# Altium project WIZARD_POC.PrjPcb
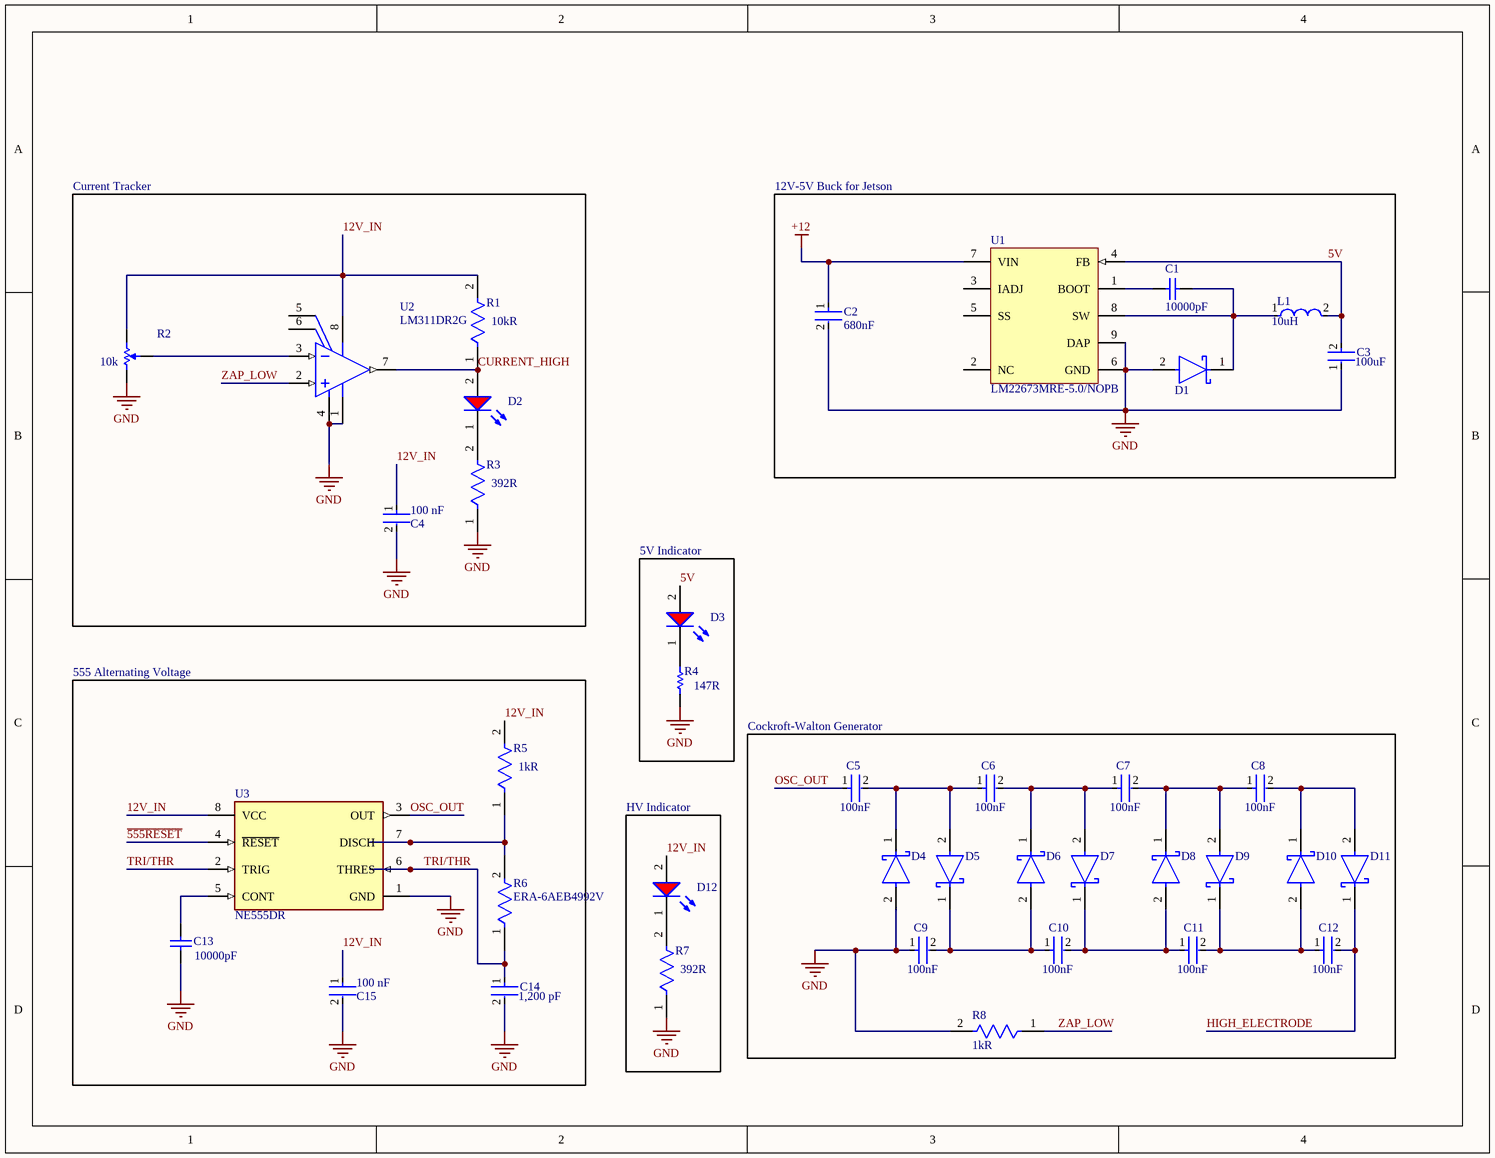
[diagram p0: WIZARD_HV.SchDoc]
2 sheets, 59 parts. Net scope: global (net labels, ports and power ports of the same name join across sheets).
Board file: WIZARD_100V.PcbDoc
Sheets:
  WIZARD_HV.SchDoc
  WIZARD_Control.SchDoc

## Sheet WIZARD_HV.SchDoc
size Letter; SheetNumber: 1; SheetTotal: 2

### Parts
C1  Capacitance: 10000pF  [CAPC2013X75X45LL10T25]  (hidden comment: CL21B103KBANNNC)
C2  Capacitance: 680nF  [FP-CGA4J-MFG]  (hidden comment: CGA4J3X7R1E684K125AB)
C3  Parameter 1: 100uF  [FP-GRM31C-0_3-e0_3_0_8-IPC_B]  (hidden comment: GRM31CR61A107MEA8L)
C4  Capacitance: 100 nF  [FP-CC0805-0_85-MFG]  (hidden comment: CC0805KRX7R9BB104)
C5  Capacitance: 100nF  [FP-C2012-125-0_2-IPC_B]  (hidden comment: C2012X7T2E104K125AA)
C6  Capacitance: 100nF  [FP-C2012-125-0_2-IPC_B]  (hidden comment: C2012X7T2E104K125AA)
C7  Capacitance: 100nF  [FP-C2012-125-0_2-IPC_B]  (hidden comment: C2012X7T2E104K125AA)
C8  Capacitance: 100nF  [FP-C2012-125-0_2-IPC_B]  (hidden comment: C2012X7T2E104K125AA)
C9  Capacitance: 100nF  [FP-C2012-125-0_2-IPC_B]  (hidden comment: C2012X7T2E104K125AA)
C10  Capacitance: 100nF  [FP-C2012-125-0_2-IPC_B]  (hidden comment: C2012X7T2E104K125AA)
C11  Capacitance: 100nF  [FP-C2012-125-0_2-IPC_B]  (hidden comment: C2012X7T2E104K125AA)
C12  Capacitance: 100nF  [FP-C2012-125-0_2-IPC_B]  (hidden comment: C2012X7T2E104K125AA)
C13  Capacitance: 10000pF  [CAPC2013X75X45LL10T25]  (hidden comment: CL21B103KBANNNC)
C14  Capacitance: 1,200 pF  [FP-C0805C-DN-MFG]  (hidden comment: C0805C122K5RACTU)
C15  Capacitance: 100 nF  [FP-CC0805-0_85-MFG]  (hidden comment: CC0805KRX7R9BB104)
D1  SK520B  [FP-SMB-MFG]  (value not drawn)
D2  150080RS75000  [WL-SMCW_0805_150080xx75000]  (value not drawn)
D3  150080RS75000  [WL-SMCW_0805_150080xx75000]  (value not drawn)
D4  SK520B  [FP-SMB-MFG]  (value not drawn)
D5  SK520B  [FP-SMB-MFG]  (value not drawn)
D6  SK520B  [FP-SMB-MFG]  (value not drawn)
D7  SK520B  [FP-SMB-MFG]  (value not drawn)
D8  SK520B  [FP-SMB-MFG]  (value not drawn)
D9  SK520B  [FP-SMB-MFG]  (value not drawn)
D10  SK520B  [FP-SMB-MFG]  (value not drawn)
D11  SK520B  [FP-SMB-MFG]  (value not drawn)
D12  150080RS75000  [WL-SMCW_0805_150080xx75000]  (value not drawn)
L1  Inductance: 10uH  [FP-SRP1038A-100M-MFG]  (hidden comment: SRP1038A-100M)
R1  Resistance: 10kR  [FP-RR1220-IPC_A]  (hidden comment: RR1220P-103-D)
R2  Resistance (Ohms): 10k  [RES-POT-3]  (hidden comment: P090S-14T20BR10K)
R3  Resistance: 392R  [FP-RMCF0805-IPC_A]  (hidden comment: RMCF0805FT392R)
R4  value 147R  [RESC2013X60X35NL10T20]  (hidden comment: RC0805FR-07147RL)
R5  Resistance: 1kR  [FP-RR1220-IPC_A]  (hidden comment: RR1220P-102-D)
R6  ERA-6AEB4992V  [FP-ERA6A_MFG]
R7  Resistance: 392R  [FP-RMCF0805-IPC_A]  (hidden comment: RMCF0805FT392R)
R8  Resistance: 1kR  [FP-RR1220-IPC_A]  (hidden comment: RR1220P-102-D)
U1  LM22673MRE-5.0/NOPB  [MRA08B_L]
U2  LM311DR2G  [ONSC-SOIC-8-751-07_V]
U3  NE555DR  [FP-D0008A-IPC_A]

### Blocks framed on the sheet
Current Tracker: C4 D2 R1-R3 U2
12V-5V Buck for Jetson: C1-C3 D1 L1 U1
5V Indicator: D3 R4
555 Alternating Voltage: C13-C15 R5 R6 U3
Cockroft-Walton Generator: C5-C12 D4-D11 R8
HV Indicator: D12 R7

### Nets
+12: C2.1 U1.7(VIN)
GND: C2.2 C3.1 C4.2 C9.1 C13.1 C14.2 C15.2 D1.2(A) D4.2(A) R2.1 R3.1 R4.1 R7.1 R8.2 U1.6(GND) U1.9(DAP) U2.1(GND) U2.4(VEE) U3.1(GND)
~{555RESET}: U3.4(~{RESET})
5V: C3.2 D3.2(A) L1.2 U1.4(FB)
12V_IN: C4.1 C15.1 D12.2(A) R1.2 R2.3 R5.2 U2.8(VCC) U3.8(VCC)
CURRENT_HIGH: D2.2(A) R1.1 U2.7(OUT)
HIGH_ELECTRODE: C12.2 D11.1(C)
OSC_OUT: C5.1 U3.3(OUT)
TRI/THR: C14.1 R6.1 U3.2(TRIG) U3.6(THRES)
ZAP_LOW: R8.1 U2.2(IN+)
NetC1_1: C1.1 D1.1(C) L1.1 U1.8(SW)
NetC1_2: C1.2 U1.1(BOOT)
NetC5_2: C5.2 C6.1 D4.1(C) D5.2(A)
NetC6_2: C6.2 C7.1 D6.1(C) D7.2(A)
NetC7_2: C7.2 C8.1 D8.1(C) D9.2(A)
NetC8_2: C8.2 D10.1(C) D11.2(A)
NetC9_2: C9.2 C10.1 D5.1(C) D6.2(A)
NetC10_2: C10.2 C11.1 D7.1(C) D8.2(A)
NetC11_2: C11.2 C12.1 D9.1(C) D10.2(A)
NetC13_2: C13.2 U3.5(CONT)
NetD2_1: D2.1(K) R3.2
NetD3_1: D3.1(K) R4.2
NetD12_1: D12.1(K) R7.2
NetR2_2: R2.2 U2.3(IN-)
NetR5_1: R5.1 R6.2 U3.7(DISCH)

Not connected (* = marked no-connect by the designer): U1 2(NC) 3(IADJ) 5(SS); U2 5(BALANCE) 6(BALANCE/STROBE)

### Library data of the parts
C1 C13 = CMP-2000-06105-1: Multilayer Ceramic Capacitor, 10 nF, 50 V, -55 to 125 degC, 2-Pin SMD, RoHS, Tape and Reel; Manufacturer: Samsung Electro-Mechanics; Tolerance (%): ±10%; Dielectric: X7R; Rated Voltage: 50V; Package Description: 2-Pin Surface Mount Device, Body 2 x 1.25 mm; Datasheet Version: 11/2010; Package Reference: 0805; Case Size/Dimension: 0805; Datasheet URL: https://datasheet.ciiva.com/29199/455082-da-01-en-vs-kondensator-0805-29199459.pdf; Mounting Technology: SurfaceMount; Manufacturer URL: http://www.samsungsem.com/global/index.jsp
C2 = CMP-08246-002437-1: Cap Ceramic 680nF 25V X7R 10% Pad SMD 0805 +125°C Automotive T/R; Case Code (Imperial): 0805; Termination: SMD/SMT; Ratings: AEC-Q200; Height: 1.25mm; Depth: 1.25mm; Max Operating Temperature: 125°C; Case Code (Metric): 2012; Lead Free: Lead Free; Width: 0.049inch; Weight: 0.000194oz; Min Operating Temperature: -55°C; Package Quantity: 2000; Dielectric: X7R; Case/Package: 0805; REACH SVHC: No SVHC; Thickness: 0.057inch; Mount: Surface Mount; Composition: Ceramic; Voltage Rating: 25V; Length: 2mm; Packaging: Tape and Reel; Tolerance: 10%; Voltage Rating (DC): 25V
C3 = CMP-06035-033997-1: Chip Multilayer Ceramic Capacitors for General Purpose, 1206, 100uF, X5R, 15%, 20%, 10V
C4 C15 = CMP-2100-03606-3: CAP CER 0.1UF 50V X7R 0805; Manufacturer: Yageo; Tolerance: 0.1; Value: 100 nF; Material: Ceramic; Device Class L1: Passive Components; ComponentLink2Description: Datasheet; Package: CC0805-0.85; Manufacturer Part Number: CC0805KRX7R9BB104; Digikey Description: CAP CER 0.1UF 50V X7R 0805; Device Class L3: Ceramic Capacitors; Temperature: -30°C to +85°C; Temperature Characteristic: X7R; Voltage Rating: 50 V; Height: 0.95mm; RoHS: TRUE; Ipc Land Pattern Name: CAPC200125X85; Device Class L2: Capacitors; Category: Cap; Temperature Range Low: -30°C; Temperature Range High: +85°C; Mouser Description: Multilayer Ceramic Capacitors MLCC - SMD/SMT 100nF 50V X7R 10%; Footprint Url: http://www.yageo.com/exep/pages/download/literatures/UPY-C_GEN_24.pdf; Automotive: No; Octopart: https://octopart.com/cc0805krx7r9bb104-yageo-192993; Lead Free: Yes; ComponentLink2URL: http://www.yageo.com/documents/recent/UPY-GPHC_Y5V_6.3V-to-50V_8.pdf
C5-C12 = CMP-08246-006438-1: Multilayer Ceramic Capacitors 100nF ±10% 250V X7T SMD 0805; Depth: 1.25mm; Package Quantity: 1; Case/Package: 0805; Case Code (Metric): 2012; Case Code (Imperial): 0805; Thickness: 0.057inch; Tolerance: 10%; Length: 2mm; Radiation Hardening: No; Max Operating Temperature: 125°C; Voltage Rating (DC): 250V; Height: 1.25mm; Construction: Flat; Dielectric: X7T; Min Operating Temperature: -55°C; RoHS Compliant: Yes; REACH SVHC: No SVHC; Width: 0.049inch; Series: C; Packaging: Tape and Reel; Lead Free: Lead Free; Mount: Surface Mount; Voltage Rating: 250V
C14 = CMP-2007-00286-2: CAP CER 1200PF 50V 10% X7R 0805; Manufacturer: KEMET; Temperature Coefficient: 30ppm/°C; Tolerance: 0.1; Material: Ceramic; Value: 1,200 pF; Manufacturer Part Number: C0805C122K5RACTU; Temperature: -55°C to +125°C; Package: C0805C-DN; ComponentLink2Description: Datasheet; RoHS: TRUE; Height: 0.88mm; Device Class L2: Capacitors; Automotive: No; Voltage Rating: 50 V; Temperature Range High: +125°C; Octopart: https://octopart.com/c0805c122k5ractu-kemet-8370191; Ipc Land Pattern Name: CAPC200125X78; Category: Cap; Device Class L3: Ceramic Capacitors; Temperature Characteristic: X7R; Lead Free: Yes; Mouser Description: Cap Ceramic 0.0012uF 50V X7R 10% SMD 0805 125C Plastic T/R; ComponentLink2URL: https://content.kemet.com/datasheets/KEM_C1003_C0G_SMD.pdf; Device Class L1: Passive Components; Digikey Description: CAP CER 1200PF 50V 10% X7R 0805; Temperature Range Low: -55°C
D1 D4-D11 = CMP-10078-124483505-1: SK520B Diode Schottky 200V 5A Smb; Peak Reverse Current: 200nA; Capacitance: 140pF; Max Junction Temperature (Tj): 150°C; Max Forward Surge Current (Ifsm): 110A; Max Repetitive Reverse Voltage (Vrrm): 200V; NexarPartId: 124483505; Case/Package: SMB; Forward Current: 5A; Max Operating Temperature: 150°C; Min Operating Temperature: -55°C; Height: 2.6mm; Reverse Voltage: 200V
D2 D3 D12 = CMP-1426-00011-3: LED Uni-Color Red 630nm 2-Pin Chip 0805(2012Metric) T/R; Viewing Angle: 140°; Max Junction Temperature (Tj): 95°C; Power Dissipation: 72mW; Forward Current: 100mA; Forward Voltage: 2V; Wavelength: 625nm; Test Current: 20mA; Max Reverse Voltage (DC): 5V; Luminous Intensity: 150mcd; Lens Style: Clear, Rectangular; REACH SVHC: Unknown; Height: 700µm; Case Code (Metric): 2012; Peak Wavelength: 630nm; Length: 2mm; Width: 1.25mm; RoHS: Compliant; Packaging: Tape and Reel; Dominant Wavelength: 625nm; Color: Red; Case Code (Imperial): 0805; Min Operating Temperature: -40°C; Mount: Surface Mount; Max Operating Temperature: 85°C; Case/Package: 0805
L1 = CMP-07248-000083-1: FIXED IND 10UH 7.5A 30 MOHM SMD; Tolerance: 20%; Test Frequency: 100kHz; Self Resonant Frequency: 10MHz; Q Factor: 20; Core Material: Carbonyl Powder; Shielding: Shielded; DC Resistance (DCR): 30mR; Saturation Current: 12A; Mount: Surface Mount; Military Standard: Not; Max Operating Temperature: 150°C; Length: 11mm; Min Operating Temperature: -40°C; Ratings: AEC-Q200; Termination: SMD/SMT; RMS Current (Irms): 7.5A; Packaging: Tape and Reel; RoHS Compliant: Yes; Width: 0.394inch; Height: 3.8mm; Package Quantity: 500; DC Current: 7.5A; Case/Package: Nonstandard; Depth: 10.3mm; Max DC Current: 7.5A; Height - Seated (Max): 0.157inch; REACH SVHC: No SVHC; Resistor Type: Wirewound; Current Rating: 7.5A; Inductance Tolerance: 20%
R1 = CMP-2001-03215-2: 10kΩ ±0.5% 0.1W 1/10W Chip Resistor 0805 (2012 Metric) Thin Film; Max Power Dissipation: 100mW; Voltage Rating: 100V; Temperature Coefficient: 25ppm/°C; Size Code: 0805; RoHS Compliant: Yes; Package Quantity: 1; Resistance Tolerance: 0.5%; Depth: 1.25mm; Lead Free: Lead Free; Series: RR; Min Operating Temperature: -55°C; Weight: 0.000194oz; Width: 1.25mm; Packaging: Tape and Reel; Termination: SMD/SMT; Length: 2mm; Power Rating: 100mW; Case Code (Metric): 2012; Resistor Type: Thin Film; Height: 0.4mm; Case/Package: 0805; Case Code (Imperial): 0805; Technology: THIN FILM; Max Operating Temperature: 125°C; Voltage Rating (DC): 100V; Number of Terminations: 2; Tolerance: 0.5%
R2 = CMP-2000-06871-1: 9 mm Rotary Potentiometer, Insulated Shaft, Conductive Plastic Element, 10 KOhm, -20 to 70 degC, 3-Pin THD, RoHS, Tray; Manufacturer: BI Technologies; Actuator Type: Knurled; Power Rating: 0.03W; Tolerance: ±20%; Actuator Diameter: 0.236"(6.00mm); Other Names: 987-1277P090S14T20BR10K; Actuator Length: 0.787"(20.00mm); Number of Gangs: 1; Online Catalog: P090Series; Power (Watts): 0.03W,1/32W; Built in Switch: Detent; Adjustment Type: TopAdjustment; Rotation: 280°; Package Description: POT, 3-Leads, Body 9.8 x 12.5 mm, Pitch 2.5 mm; Bushing Thread: -; Package Reference: POT-3; Datasheet URL: http://www.bitechnologies.com/pdfs/p090.pdf; Packaging: Tray; Manufacturer URL: http://www.bi-technologies.net/; Package URL: http://www.bitechnologies.com/pdfs/p090.pdf; Mounting Technology: ThroughHole; Datasheet Version: 07/2008; Taper: Linear; Resistive Material: ConductivePlastic; Mounting Type: ThroughHole; Temperature Coefficient: -; Standard Package: 1; Category: Potentiometers,VariableResistors; Family: RotaryPotentiometers,Rheostats; Termination Style: PCBPins,BoardLocks; Series: P090; Number of Turns: 1
R3 R7 = CMP-26527-007282-1: 392Ω ±1% 0.125W 0805 Thick Film Chip Resistor AEC-Q200 compliant; Temperature Coefficient: 100ppm/°C; Max Power Dissipation: 125mW; Number of Terminations: 2; Size Code: 0805; Tolerance: 1%; Radiation Hardening: No; Packaging: Tape and Reel; Resistor Type: Thick Film; RoHS Compliant: Yes; Military Standard: Not; Contact Plating: Tin; Length: 0.079inch; Case Code (Imperial): 0805; Width: 0.049inch; Series: RMCF; Case/Package: 0805; Power Rating: 125mW; Min Operating Temperature: -55°C; Construction: Rectangular; Max Operating Temperature: 155°C; Mount: Surface Mount; Depth: 1.25mm; Height: 0.026inch; Lead Free: Lead Free; Features: Automotive AEC-Q200; Case Code (Metric): 2012
R4 = CMP-2001-00922-1: Manufacturer: Yageo; Part Number: RC0805FR-07147RL
R5 R8 = CMP-2001-03210-2: 1kΩ ±0.5% 0.1W 1/10W Chip Resistor 0805 (2012 Metric) Thin Film; Voltage Rating (DC): 100V; Temperature Coefficient: 25ppm/°C; Power Rating: 100mW; Packaging: Tape and Reel; Max Operating Temperature: 125°C; Resistor Type: Thin Film; Length: 2mm; Number of Terminations: 2; Resistance Tolerance: 0.5%; Termination: SMD/SMT; Height: 0.4mm; Max Power Dissipation: 100mW; Lead Free: Lead Free; Min Operating Temperature: -55°C; Size Code: 0805; Voltage Rating: 100V; Package Quantity: 1; Width: 1.25mm; Depth: 1.25mm; Case/Package: 0805; Case Code (Imperial): 0805; Case Code (Metric): 2012; Tolerance: 0.5%; Series: RR; RoHS Compliant: Yes; Technology: THIN FILM
R6 = CMP-2001-00839-2: Res Thin Film 0805 49.9K Ohm 0.1% 0.125W(1/8W) +/-25ppm/ßC SMD Automotive T/R; Power Rating: 125mW; Resistance: 49.9kΩ; Temperature Coefficient: 25ppm/°C; Voltage Rating (DC): 100V; Weight: 5.499807mg; Lead Free: Lead Free; Max Operating Temperature: 155°C; Number of Terminations: 2; Case Code (Metric): 2012; Case/Package: 0805; Lifecycle Status: Production; Case Code (Imperial): 0805; Composition: Metal Film, Thin Film; RoHS: Compliant; Features: Automotive AEC-Q200; Radiation Hardening: No; Termination: SMD/SMT; Depth: 1.25mm; Mount: Surface Mount; Number of Pins: 2; Contact Plating: Tin; Min Operating Temperature: -55°C; REACH SVHC: Unknown; Tolerance: 0.1%; Length: 2mm; Height: 500µm; Schedule B: 8533210045, 8533210045; Military Standard: Not; Max Power Dissipation: 125mW; Packaging: Cut Tape; Voltage Rating: 100V
U1 = CMP-0069-00738-2: 3A SIMPLE SWITCHER®, Step-Down Voltage Regulator with Adjustable Soft-Start and Current Limit, 8-pin PSOP, Pb-Free; Manufacturer: National Semiconductor; PowerWise: N; PackageTopMarking: NSXYTT*L22673*5.0; PinCount: 8; ComponentLink3URL: http://www.national.com/packaging/folders/mra08b.html; PackageDescription: Molded, PSOP .193 x .154 x .058in, 8 Lead, .050in Pitch, Large DAP; DatasheetVersion: Nov-2008; ComponentLink2URL: http://www.national.com/pf/LM/LM22673.html; RevisionNote: Component URLs added; ComponentLink3Description: MRA08B Package Page; PackageReference: MRA08B; ComponentLink2Description: LM22673 Web Page; PackageVersion: revB, Dec-2007; CompType: Switcher; ComponentLink1URL: http://www.national.com/ds/LM/LM22673.pdf; RoHS: Y; Code_JEDEC: MS-012-AA; ComponentLink1Description: LM22673 Datasheet
U2 = CMP-1305-00058-1: Single Comparator, 5 to 30 V, 0 to 70 degC, 8-Pin SOIC, Pb-Free, Tape and Reel; Manufacturer: On Semiconductor; VCC Max (V): 30; VCC Min (V): 5; ICC Typ (mA): 2.4; ComponentLink3Description: Package Specification; ComponentLink1URL: http://www.onsemi.com/; ComponentLink1Description: Manufacturer URL; Mounting Technology: Surface Mount; PackageDescription: 8-Pin Small Outline Integrated Circuit, Body 4.9 x 3.9 mm, Pitch 1.27 mm; ComponentLink2Description: Datasheet; RoHS: TRUE; ComponentLink2URL: http://www.onsemi.com/pub_link/Collateral/LM211-D.PDF; PackageVersion: Rev. AK, 02/2011; PackageReference: SOIC-8-751-07; DatasheetVersion: Rev. 6; Packing: Tape and Reel; ComponentLink3URL: http://www.onsemi.com/pub_link/Collateral/751-07.PDF; PartNumber: LM311DR2G
U3 = CMP-1685-00007-2: IC OSC SGL TIMER 100KHZ 8-SOIC; Low Level Output Current: 200mA; Quiescent Current: 15mA; Min Supply Voltage: 4.5V; Number of Timers/Counters: 1; Max Supply Voltage: 16V; Operating Supply Current: 10mA; High Level Output Current: -200mA; Packaging: Tape and Reel; Frequency: 100kHz; Weight: 0.002561oz; REACH SVHC: No SVHC; Package Quantity: 2500; Width: 3.91mm; Max Operating Temperature: 70°C; Contact Plating: Gold; Lead Free: Lead Free; Number of Pins: 8; Min Operating Temperature: 0°C; Radiation Hardening: No; Length: 4.9mm; Case/Package: SOIC; Height: 1.58mm; Mount: Surface Mount

## Sheet WIZARD_Control.SchDoc
size Letter; SheetNumber: 2; SheetTotal: 2
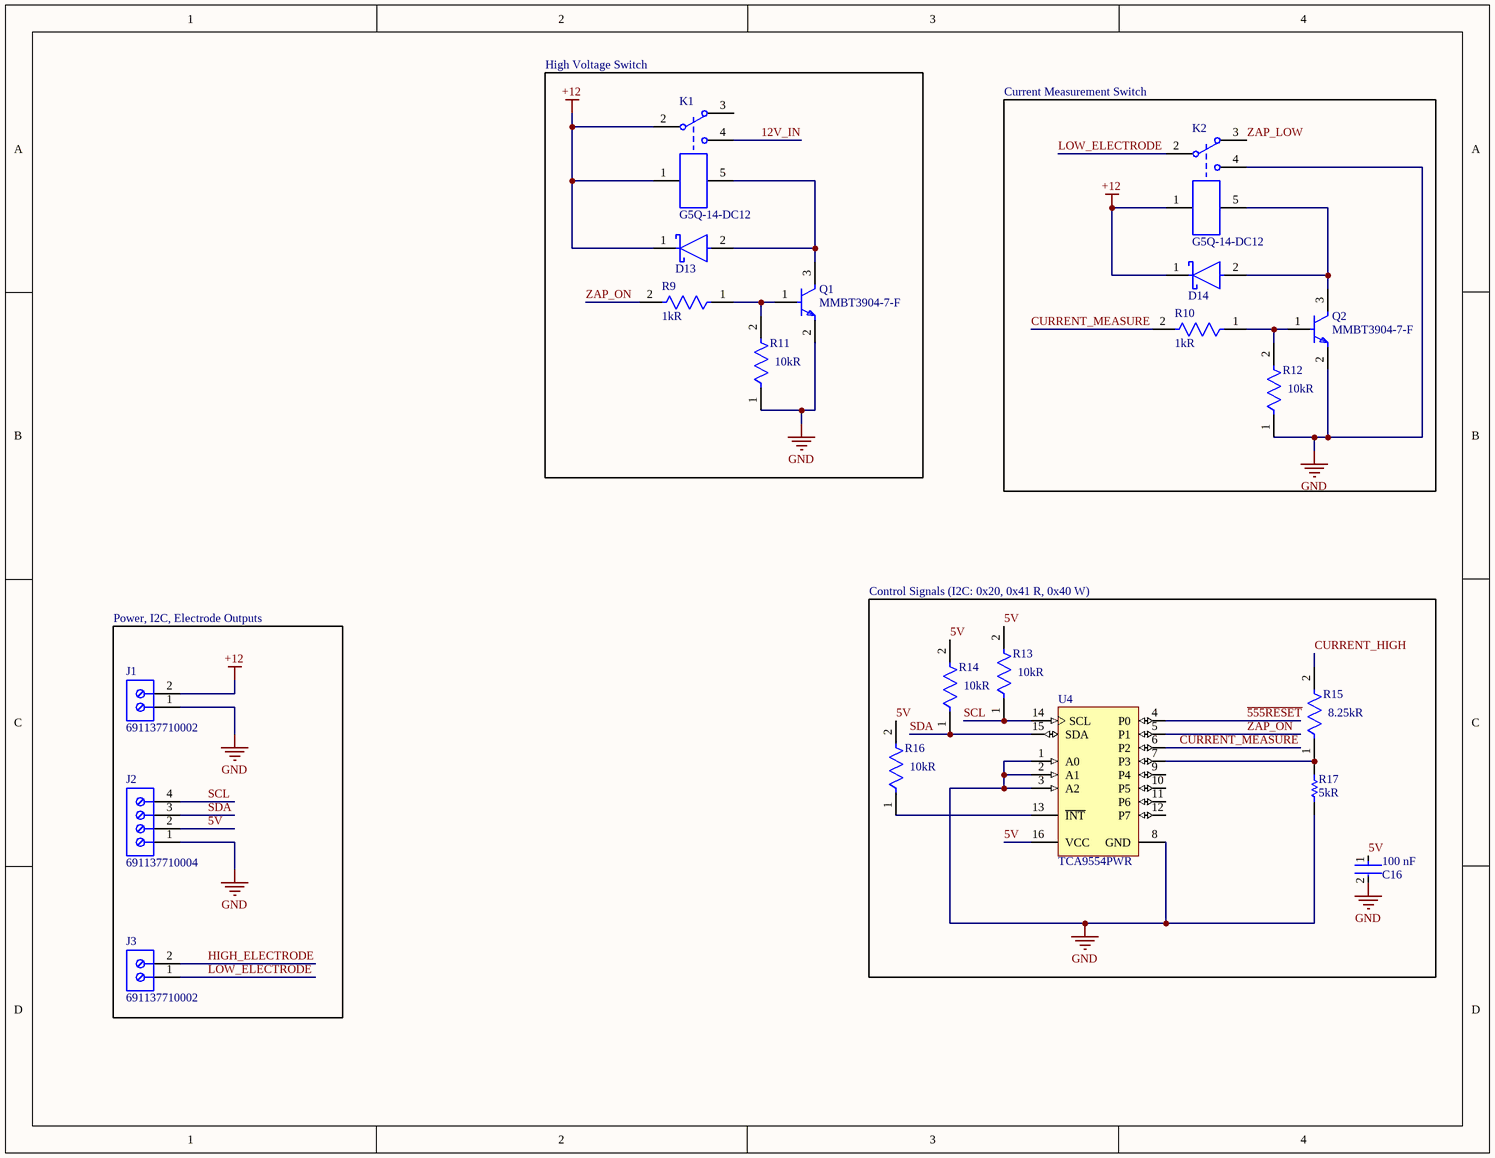
[diagram p1: WIZARD_Control.SchDoc]

### Parts
C16  Capacitance: 100 nF  [FP-CC0805-0_85-MFG]  (hidden comment: CC0805KRX7R9BB104)
D13  SK520B  [FP-SMB-MFG]  (value not drawn)
D14  SK520B  [FP-SMB-MFG]  (value not drawn)
J1  691137710002  [691137710002]
J2  691137710004  [691137710004]
J3  691137710002  [691137710002]
K1  G5Q-14-DC12  [OMRON-G5Q-14-5_V]
K2  G5Q-14-DC12  [OMRON-G5Q-14-5_V]
Q1  MMBT3904-7-F  [FP-SOT23-IPC_A]
Q2  MMBT3904-7-F  [FP-SOT23-IPC_A]
R9  Resistance: 1kR  [FP-RR1220-IPC_A]  (hidden comment: RR1220P-102-D)
R10  Resistance: 1kR  [FP-RR1220-IPC_A]  (hidden comment: RR1220P-102-D)
R11  Resistance: 10kR  [FP-RR1220-IPC_A]  (hidden comment: RR1220P-103-D)
R12  Resistance: 10kR  [FP-RR1220-IPC_A]  (hidden comment: RR1220P-103-D)
R13  Resistance: 10kR  [FP-RR1220-IPC_A]  (hidden comment: RR1220P-103-D)
R14  Resistance: 10kR  [FP-RR1220-IPC_A]  (hidden comment: RR1220P-103-D)
R15  Resistance: 8.25kR  [FP-CRCW0805-e3-IPC_B]  (hidden comment: CRCW08058K25FKEA)
R16  Resistance: 10kR  [FP-RR1220-IPC_A]  (hidden comment: RR1220P-103-D)
R17  value 5kR  [RESC2013X50X30ML20T20]  (hidden comment: CRCW08055K00FKTA)
U4  TCA9554PWR  [PW0016A_M]

### Blocks framed on the sheet
High Voltage Switch: D13 K1 Q1 R9 R11
Current Measurement Switch: D14 K2 Q2 R10 R12
Power, I2C, Electrode Outputs: J1-J3
Control Signals (I2C: 0x20, 0x41 R, 0x40 W): C16 R13-R17 U4

### Nets
+12: D13.1(C) D14.1(C) J1.2 K1.1 K1.2 K2.1
GND: C16.2 J1.1 J2.1 K2.4 Q1.2(E) Q2.2(E) R11.1 R12.1 R17.1 U4.1(A0) U4.2(A1) U4.3(A2) U4.8(GND)
~{555RESET}: U4.4(P0)
5V: C16.1 J2.2 R13.2 R14.2 R16.2 U4.16(VCC)
12V_IN: K1.4
CURRENT_HIGH: R15.2
CURRENT_MEASURE: R10.2 U4.6(P2)
HIGH_ELECTRODE: J3.2
LOW_ELECTRODE: J3.1 K2.2
SCL: J2.4 R13.1 U4.14(SCL)
SDA: J2.3 R14.1 U4.15(SDA)
ZAP_LOW: K2.3
ZAP_ON: R9.2 U4.5(P1)
NetD13_2: D13.2(A) K1.5 Q1.3(C)
NetD14_2: D14.2(A) K2.5 Q2.3(C)
NetQ1_1: Q1.1(B) R9.1 R11.2
NetQ2_1: Q2.1(B) R10.1 R12.2
NetR15_1: R15.1 R17.2 U4.7(P3)
NetR16_1: R16.1 U4.13(~{INT})

Not connected (* = marked no-connect by the designer): K1 3; U4 9(P4) 10(P5) 11(P6) 12(P7)

### Library data of the parts
C16 = CMP-2100-03606-3: as C4 on sheet WIZARD_HV; Device Class L1: Passive Components; ComponentLink2Description: Datasheet; Package: CC0805-0.85; Manufacturer Part Number: CC0805KRX7R9BB104; Digikey Description: CAP CER 0.1UF 50V X7R 0805; Device Class L3: Ceramic Capacitors; Temperature: -30°C to +85°C; Temperature Characteristic: X7R; Voltage Rating: 50 V; Height: 0.95mm; RoHS: TRUE; Ipc Land Pattern Name: CAPC200125X85; Device Class L2: Capacitors; Category: Cap; Temperature Range Low: -30°C; Temperature Range High: +85°C; Mouser Description: Multilayer Ceramic Capacitors MLCC - SMD/SMT 100nF 50V X7R 10%; Footprint Url: http://www.yageo.com/exep/pages/download/literatures/UPY-C_GEN_24.pdf; Automotive: No; Octopart: https://octopart.com/cc0805krx7r9bb104-yageo-192993; Lead Free: Yes; ComponentLink2URL: http://www.yageo.com/documents/recent/UPY-GPHC_Y5V_6.3V-to-50V_8.pdf
D13 D14 = CMP-10078-124483505-1: as D1 on sheet WIZARD_HV; Max Repetitive Reverse Voltage (Vrrm): 200V; NexarPartId: 124483505; Case/Package: SMB; Forward Current: 5A; Max Operating Temperature: 150°C; Min Operating Temperature: -55°C; Height: 2.6mm; Reverse Voltage: 200V
J1 J3 = CMP-1502-03324-2: NexarPartId: 78871135; Voltage Rating: 300V; Number of Contacts: 2; Current Rating: 16A; Lead Pitch: 5mm; Height: 11.6mm; Packaging: Box; RoHS: Non-Compliant; Contact Material: Nickel, Tin; Max Operating Temperature: 120°C; Number of Pins: 2; Min Operating Temperature: -30°C; Number of Rows: 1
J2 = CMP-1502-03326-2: NexarPartId: 78871140; Packaging: Box; RoHS: Non-Compliant; Number of Pins: 4; Lead Pitch: 5mm
K1 K2 = CMP-2000-06307-2: A Miniature Power Relay with 1-Pole 10 A Switching Capacity, 12 V, 33.3 mA, -40 to 105 degC, 5-Pin THD, RoHS, Bulk; Manufacturer: Omron Electronic Components; PartNumber: G5Q; Coil Resistance: 360Ohm; Coil Voltage: 12V; Coil Current: 33.3mA; Contact Form: SPDT; Power Rating: 0.4W; Manufacturer URL: http://www.omron.com/; Package URL: https://www.omron.com/ecb/products/pdf/en-g5q.pdf; Datasheet URL: https://www.omron.com/ecb/products/pdf/en-g5q.pdf; Contact Material: SilverAlloy; Mounting Style: ThroughHole; Mounting Technology: ThroughHole; Package Description: 5-Pin Through Hole Device, Body 20 x 10 mm; Current Rating: 33.3mA; Package Reference: G5Q-14-5; Datasheet Version: 03/2016
Q1 Q2 = CMP-2000-04931-2: TRANS NPN 40V 0.2A SMD SOT23-3; Frequency: 300MHz; Power Dissipation: 350mW; Element Configuration: Single; Max Power Dissipation: 300mW; Max Collector Current: 200mA; Collector Emitter Saturation Voltage: 300mV; Number of Elements: 1; hFE Min: 100; Collector Base Voltage (VCBO): 60V; Emitter Base Voltage (VEBO): 6V; Contact Plating: Tin; Package Quantity: 3000; Max Frequency: 300MHz; REACH SVHC: No SVHC; Max Operating Temperature: 150°C; Width: 1.4mm; Collector Emitter Voltage (VCEO): 40V; Voltage Rating (DC): 40V; Radiation Hardening: No; Case/Package: SOT-23; Height: 1mm; Collector Emitter Breakdown Voltage: 40V; Length: 3.05mm; Polarity: NPN; Packaging: Tape and Reel; Number of Pins: 3; Min Operating Temperature: -55°C; Gain Bandwidth Product: 300MHz; Mount: Surface Mount; Weight: 0.000282oz; Continuous Collector Current: 200mA; Transition Frequency: 300MHz; Max Breakdown Voltage: 40V; Lead Free: Lead Free
R9 R10 = CMP-2001-03210-2: as R5 on sheet WIZARD_HV; Packaging: Tape and Reel; Max Operating Temperature: 125°C; Resistor Type: Thin Film; Length: 2mm; Number of Terminations: 2; Resistance Tolerance: 0.5%; Termination: SMD/SMT; Height: 0.4mm; Max Power Dissipation: 100mW; Lead Free: Lead Free; Min Operating Temperature: -55°C; Size Code: 0805; Voltage Rating: 100V; Package Quantity: 1; Width: 1.25mm; Depth: 1.25mm; Case/Package: 0805; Case Code (Imperial): 0805; Case Code (Metric): 2012; Tolerance: 0.5%; Series: RR; RoHS Compliant: Yes; Technology: THIN FILM
R11-R14 R16 = CMP-2001-03215-2: as R1 on sheet WIZARD_HV; Size Code: 0805; RoHS Compliant: Yes; Package Quantity: 1; Resistance Tolerance: 0.5%; Depth: 1.25mm; Lead Free: Lead Free; Series: RR; Min Operating Temperature: -55°C; Weight: 0.000194oz; Width: 1.25mm; Packaging: Tape and Reel; Termination: SMD/SMT; Length: 2mm; Power Rating: 100mW; Case Code (Metric): 2012; Resistor Type: Thin Film; Height: 0.4mm; Case/Package: 0805; Case Code (Imperial): 0805; Technology: THIN FILM; Max Operating Temperature: 125°C; Voltage Rating (DC): 100V; Number of Terminations: 2; Tolerance: 0.5%
R15 = CMP-2001-04150-2: RES Thick Film, 8.25kΩ, 1%, 0.125W, 100ppm/°C, 0805; Max Power Dissipation: 125mW; Voltage Rating: 150V; Resistor Type: Thick Film; Lead Free: Lead Free; Number of Terminations: 2; Temperature Coefficient: 100ppm/°C; Military Standard: Not; Resistance Tolerance: 1%; Min Operating Temperature: -55°C; Tolerance: 1%; Termination: SMD/SMT; Power Rating: 125mW; Height: 0.45mm; Contact Plating: Tin; Length: 2mm; Width: 1.25mm; Max Operating Temperature: 155°C; Technology: THICK FILM; Case/Package: 0805; Features: Automotive AEC-Q200; Weight: 0.000194oz; Construction: Rectangular; RoHS Compliant: Yes; Series: CRCW; Packaging: Tape and Reel; Package Quantity: 5000; Depth: 1.25mm; Voltage Rating (DC): 150V; Size Code: 0805; Case Code (Imperial): 0805; Radiation Hardening: No; Case Code (Metric): 2012
R17 = CMP-2001-04239-1: Manufacturer: Vishay Dale; Part Number: CRCW08055K00FKTA
U4 = CMP-0314-00246-2: Remote 8-Bit I2C and SMBus I/O Expander, 1.65 to 5.5 V, -40 to 85 degC, 16-pin TSSOP (PW), Green (RoHS & no Sb/Br); Manufacturer: Texas Instruments; VCC(Min)(V): 1.65; Configuration Registers: Yes; I2C Address: 0100xxx; # of I/Os: 8; VCC(Max)(V): 5.5; fSCLK(Max)(MHz): 401; Max Frequency(kHz): 400; SubFamily: I2C IO Expander; Interrupt Output: Yes; Code_JEDEC: MO-153; 5V Tolerant I/O: Yes; PackageVersion: revG, Feb-2011; Vcc range(V): 1.65 to 5.5; PartNumber: TCA9554PWR; ComponentLink1URL: http://www.ti.com/general/docs/lit/getliterature.tsp?genericPartNumber=TCA9554&fileType=pdf; Mounting Technology: Surface Mount; ComponentLink1Description: Datasheet; PackageDescription: 16-Pin Plastic Thin Small Outline Package 5 x 4.4 mm Body ,0.65 mm Pitch; Eco-Plan: Green (RoHS & no Sb/Br); PackageReference: PW0016A; Low Power: Yes; DatasheetVersion: SCPS233

## Nets that join several sheets
+12: WIZARD_HV (C2.1 U1.7), WIZARD_Control (6 pins)
GND: WIZARD_HV (19 pins), WIZARD_Control (13 pins)
~{555RESET}: WIZARD_HV (U3.4), WIZARD_Control (U4.4)
5V: WIZARD_HV (C3.2 D3.2 L1.2 U1.4), WIZARD_Control (6 pins)
12V_IN: WIZARD_HV (8 pins), WIZARD_Control (K1.4)
CURRENT_HIGH: WIZARD_HV (D2.2 R1.1 U2.7), WIZARD_Control (R15.2)
HIGH_ELECTRODE: WIZARD_HV (C12.2 D11.1), WIZARD_Control (J3.2)
ZAP_LOW: WIZARD_HV (R8.1 U2.2), WIZARD_Control (K2.3)